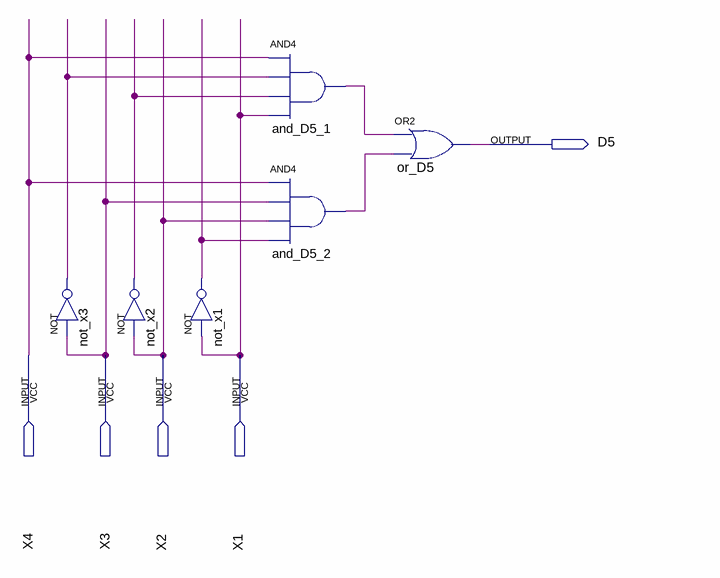
[diagram p0: schematic sheet]
// Quartus schematic conv_D5.bdf as structural Verilog: 6 symbols, 5 pins
module conv_D5 (
  input  X4,
  input  X3,
  input  X2,
  input  X1,
  output D5
);

  wire and_D5_1_out, and_D5_2_out, not_x1_out, not_x2_out, not_x3_out;

  not not_x3 (not_x3_out, X3);
  not not_x2 (not_x2_out, X2);
  not not_x1 (not_x1_out, X1);
  and and_D5_1 (and_D5_1_out, X4, not_x3_out, not_x2_out, X1);
  and and_D5_2 (and_D5_2_out, X4, X3, X2, not_x1_out);
  or or_D5 (D5, and_D5_1_out, and_D5_2_out);
endmodule
